# EAGLE design PlacaResistencia_VFinal (EAGLE 9.6.2)
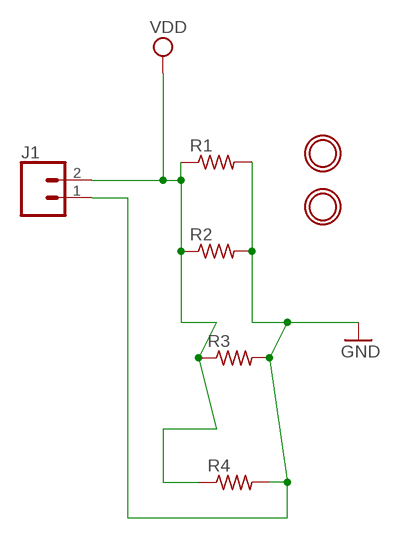
[diagram p0: schematic, sheet 1]

## Parts
GND  MOUNTINGHOLE2.5  [MOUNTINGHOLE_2.5_PLATED]
GND2  MOUNTINGHOLE2.5  [MOUNTINGHOLE_2.5_PLATED]
J1  CONN_02  [1X02]
R1  R-US_R2512  [R2512]
R2  R-US_R2512  [R2512]
R3  R-US_R2512  [R2512]
R4  R-US_R2512  [R2512]

## Nets
GND: J1.1 R1.2 R2.2 R3.2 R4.2
VDD: J1.2 R1.1 R2.1 R3.1 R4.1

## Library data of the parts
GND GND2 = microbuilder:MOUNTINGHOLE: Mounting Hole For #2 screws (0.086"/2.18mm width, 0.094"/2.4mm hole) use 2.5mm; BOM: EXCLUDE
J1 = SparkFun-Connectors:CONN_02: Multi connection point. Often used as Generic Header-pin footprint for 0.1 inch spaced/style header connections On any of the 0.1 inch spaced packages, you can populate with these: Break Away Headers - Straight <https://www.sparkfun.com/products/116> (PRT-00116) Break Away Male Headers - Right Angle <https://www.sparkfun.com/products/553> (PRT-00553) Female Headers <https://www.sparkfun.com/products/115> (PRT-00115) Break Away Headers - Machine Pin <https://www.sparkfun.com/products/117> (PRT-00117) Break Away Female Headers - Swiss Machine Pin <https://www.sparkfun.com/products/743> (PRT-00743) For SCREWTERMINALS and SPRING TERMINALS visit here: Screw Terimnals on SparkFun.com <https://www.sparkfun.com/search/results?term=Screw+Terminals> (5mm/3.5mm/2.54mm spacing) This device is also useful as a general connection point to wire up your design to another part of your project. Our various solder wires solder well into these plated through hole pads. Hook-Up Wire - Assortment (Stranded, 22 AWG) <https://www.sparkfun.com/products/11375> (PRT-11375) Hook-Up Wire - Assortment (Solid Core, 22 AWG) <https://www.sparkfun.com/products/11367> (PRT-11367) View the entire wire category on our website here <https://www.sparkfun.com/categories/141> Special notes: Molex polarized connector foot print use with: PRT-08233 with associated crimp pins and housings. 2.54_SCREWTERM for use with PRT-10571. 3.5mm Screw Terminal footprints for PRT-08084 5mm Screw Terminal footprints for use with PRT-08432
R1-R4 = rcl:R-US_: RESISTOR, American symbol; SPICEPREFIX: R

## Board
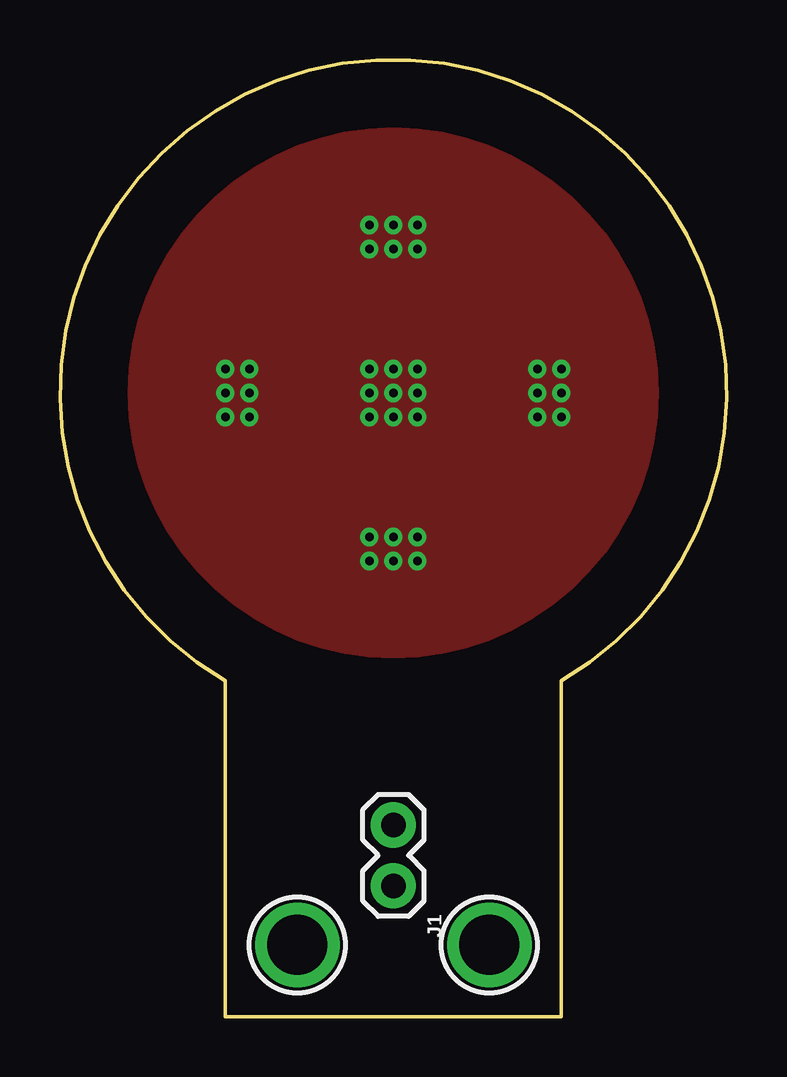
[diagram p1: board, top side]
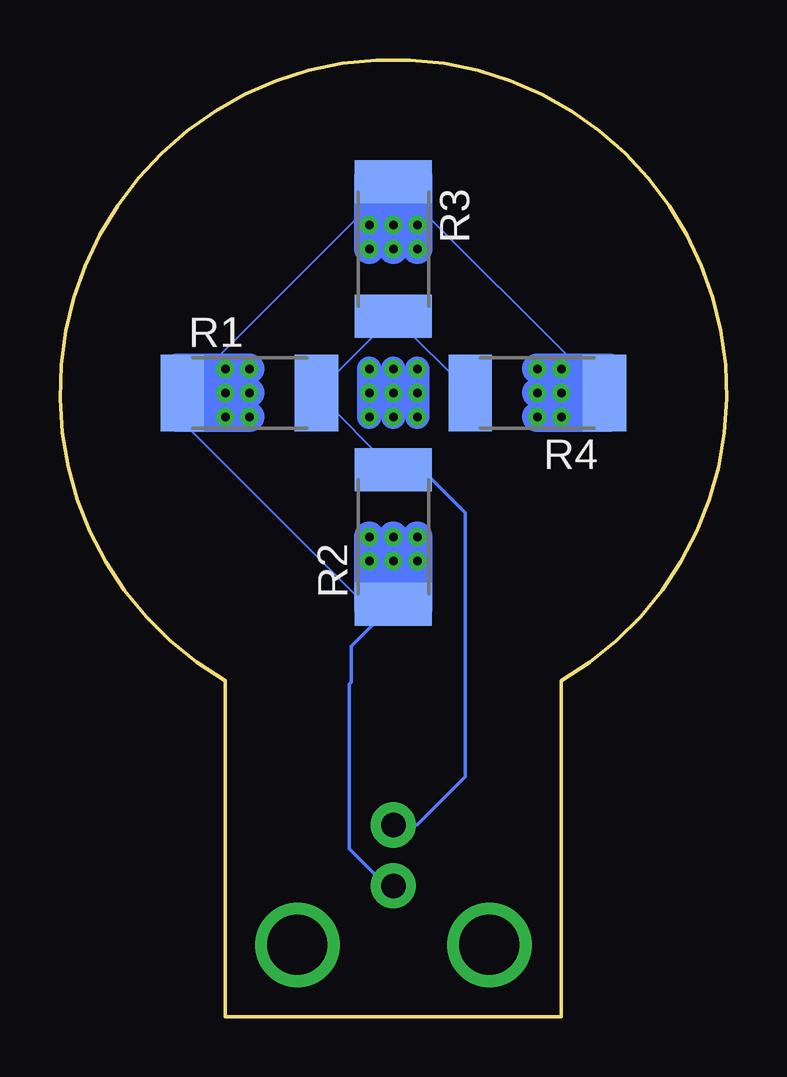
[diagram p2: board, bottom side, seen from below]

Size 27.78 x 39.87 mm. Coordinates in mm from the lower left corner, seen from the top.
Outline: 20.89,0 6.89,0 6.89,14 arc-299 20.89,14 20.89,0
Copper layers (1*16): Top 0.035mm / dielectric 1.5mm / Bottom 0.035mm
Design rules "default": minimum track width 6mil, minimum drill 0.35mm, track to track 6mil, track to pad 6mil, pad to pad 6mil, via to via 6mil, smd to smd 6mil, copper to edge 40mil, drill to drill 6mil, minimum pad ring 10mil, minimum via ring 8mil, stop-mask expansion 4mil, vias tented up to drill 0mil, thermal gap 10mil

### Footprints (pad centres in the part's own frame; a part is rotated, then mirrored left to right if it is on the bottom)
MOUNTINGHOLE_2.5_PLATED = drill 2.5 pad 3.2: P$1 0,0
1X02 = drill 1.016 pad 1.88: 1 0,0; 2 2.54,0
R2512 = smd 1.8 x 3.2: 1 -2.8,0; 2 2.8,0

### Placement (x,y rotation side)
GND  17.89,3 0 top
GND2  9.89,3 0 top
J1  13.89,8 270 top
R1  19.89,26 0 bottom
R2  13.89,20 90 bottom
R3  13.89,32 270 bottom
R4  7.89,26 180 bottom

### Tracks (layer width: path | path; a pad name or v marks a point on that pad's centre or on a via)
GND
  Bottom 0.102: R4.2 R3.2 R1.2 R2.2
  Bottom 0.152: R2.2 12.69,22.8 10.89,21 10.89,10 12.89,8 J1.1
VDD  (via drill 0.35)
  Bottom 0.102: R4.1 R3.1 R1.1 | 22.89,25 14.89,17
  Bottom 0.152: 14.49,16.6 13.99,17.1 R2.1 | 22.89,25.8 22.89,25 | 14.89,17 14.49,16.6 | 14.49,16.6 15.64,15.45 15.64,13.94 15.72,13.86 15.72,7 14.18,5.46 J1.2 | R1.1 22.79,25.9
  Bottom 1.016: v12.89,27 v12.89,25 | v14.89,25 v14.89,27 | v13.89,27 v13.89,25
  Bottom 1.27: v7.89,26 R4.1 | v7.89,27 4.89,27 | v7.89,25 4.89,25 | v13.89,20 13.99,19.9 13.99,17.1 | v12.89,20 12.89,17 | v14.89,20 14.89,17 | v19.89,27 22.89,27 | v19.89,26 R1.1 22.89,25.8 | v19.89,25 22.89,25 | v12.89,32 12.89,35 | v13.89,32 R3.1 | v14.89,32 14.89,35
  other vias: 6.89,27 6.89,26 6.89,25 12.89,19 13.89,19 14.89,19 20.89,25 20.89,26 20.89,27 12.89,33 13.89,33 14.89,33 14.89,26 13.89,26 12.89,26
  pour Top: 13.89,37 arc-90 24.89,26 arc-90 13.89,15 arc-90 2.89,26 arc-90